# Altium schematic sheet Light Sensor.SchDoc: Solar Tracker - Light Sensor
size A4; SheetNumber: 2; SheetTotal: 3
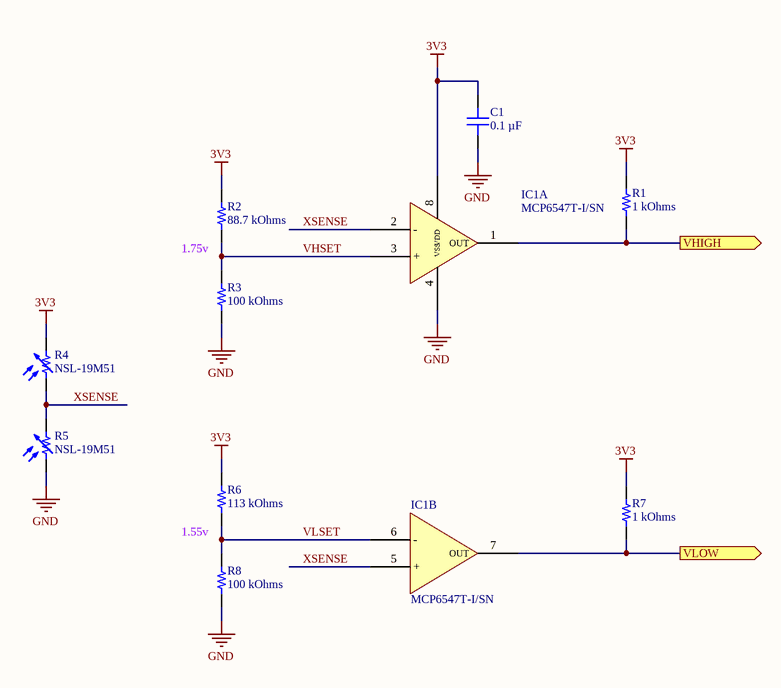
[diagram p0: Light Sensor.SchDoc]

## Parts
C1  0.1 µF  [CAP 0603_1608]
IC1  MCP6547T-I/SN  [MICROCHIP SOIC-8 SN]  (parts A,B of 2)
R1  1 kOhms  [RES 0603_1608]
R2  88.7 kOhms  [RES 0603_1608]
R3  100 kOhms  [RES 0603_1608]
R4  NSL-19M51  [ADVANCED PHOTONIX NSL-19M51]
R5  NSL-19M51  [ADVANCED PHOTONIX NSL-19M51]
R6  113 kOhms  [RES 0603_1608]
R7  1 kOhms  [RES 0603_1608]
R8  100 kOhms  [RES 0603_1608]

## Ports
VHIGH (out), VLOW (out)

## Nets
3V3: C1.2 IC1.8(VDD) R1.2 R2.2 R4.2 R6.2 R7.2
GND: C1.1 IC1.4(VSS) R3.1 R5.1 R8.1
VHIGH: IC1.1(OUT) R1.1 ; port VHIGH
VHSET: IC1.3(+) R2.1 R3.2
VLOW: IC1.7(OUT) R7.1 ; port VLOW
VLSET: IC1.6(-) R6.1 R8.2
XSENSE: IC1.2(-) IC1.5(+) R4.1 R5.2

## Notes on the sheet
- 1.75v
- 1.55v
- Title
- Size:
- Date:
- A4
- Number:
- Time:
- Revision:
- Sheet
- of
- File:

## Library data of the parts
C1 = C0603C104K5RAC7411: CAP CER 0.1UF 50V X7R 0603; manufacturer: KEMET; Tolerance: ±10%; Part Number: C0603C104K5RAC7411; Value: 0.1 µF; Applications: Bypass, Decoupling; Capacitance: 0.1 µF; componentlink1description: Datasheet; componentlink1url: https://api.kemet.com/component-edge/download/datasheet/C0603C104K5RAC7411.pdf; componentlink2description: DigiKey Link; componentlink2url: https://www.digikey.com/en/products/detail/kemet/C0603C104K5RAC7411/3317013; Device Package: 0603 (1608 Metric); lastupdated: 28/02/2022 16:36:23; Lifecycle Status: Active; Minimum Order: 15000; Mounting Type: Surface Mount, MLCC; Operating Temperature: -55°C ~ 125°C; Package / Case: 0603 (1608 Metric); packaging: TapeAndReel; partid: 2233; Part Status: Active; price: 0.01; series: SMD Comm X7R; Size / Dimension: 0.063" L x 0.031" W (1.60mm x 0.80mm); Supplier 1: DigiKey; Supplier Part Number 1: 399-7374-2-ND; Temperature Coefficient: X7R; Thickness (Max): 0.035" (0.90mm); Voltage - Rated: 50V
IC1 = MCP6547T-I/SN: IC COMP OPENDRN 1.6V DUAL 8-SOIC; Manufacturer: Microchip Technology; CMRR, PSRR (Typ): 70dB CMRR, 80dB PSRR; Current - Input Bias (Max): 1pA @ 5.5V; Current - Output (Typ): 30mA; Current - Quiescent (Max): 1µA; Hysteresis: 6.5mV; Number of Elements: 2; Output Type: CMOS, Open-Drain, Rail-to-Rail, TTL; Propagation Delay (Max): 8µs; Voltage - Input Offset (Max): 7mV @ 5.5V; Voltage - Supply, Single/Dual (±): 1.6V ~ 5.5V; Part Number: MCP6547T-I/SN; ComponentLink1Description: Datasheet; ComponentLink1URL: http://www.microchip.com/mymicrochip/filehandler.aspx?ddocname=en020853; ComponentLink2Description: DigiKey Link; ComponentLink2URL: https://www.digikey.com/en/products/detail/microchip-technology/MCP6547T-I-SN/458458; LastUpdated: 02/03/2022 20:22:27; Lifecycle Status: Active; Minimum Order: 1; Mounting Type: Surface Mount; Operating Temperature: -40°C ~ 85°C; Package / Case: 8-SOIC (0.154", 3.90mm Width); Packaging: TapeAndReel; Part Status: Active; Price: 0.53; Series: -; Supplier 1: DigiKey; Supplier Part Number 1: MCP6547T-I/SNCT-ND; Supplier Device Package: 8-SOIC; Type: General Purpose
R1 R7 = ERJ-PA3J102V: RES SMD 1K OHM 5% 1/4W 0603; Manufacturer: Panasonic Electronic Components; Power (Watts): 0.25W, 1/4W; Temperature Coefficient: ±200ppm/°C; Part Number: ERJ-PA3J102V; Value: 1 kOhms; ComponentLink1Description: Datasheet; ComponentLink1URL: https://industrial.panasonic.com/cdbs/www-data/pdf/RDO0000/AOA0000C331.pdf; ComponentLink2Description: DigiKey Link; ComponentLink2URL: https://www.digikey.com/en/products/detail/panasonic-electronic-components/ERJ-PA3J102V/5035970; Composition: Thick Film; Device Package: 0603 (1608 Metric); Features: Automotive AEC-Q200, Pulse Withstanding; Height - Seated (Max): 0.022" (0.55mm); LastUpdated: 28/02/2022 16:15:56; Lifecycle Status: Active; Minimum Order: 1; Number of Terminations: 2; Operating Temperature: -55°C ~ 155°C; Package / Case: 0603 (1608 Metric); Packaging: TapeAndReel; PartId: 17507; Part Status: Active; Price: 0.01; Ratings: AEC-Q200; Resistance: 1 kOhms; Series: ERJ-PA3; Size / Dimension: 0.063" L x 0.031" W (1.60mm x 0.80mm); Supplier 1: DigiKey; Supplier Part Number 1: P1KBZCT-ND; Supplier Device Package: 0603; Tolerance: ±5%
R2 = RC0603FR-0788K7L: RES 88.7K OHM 1% 1/10W 0603; Manufacturer: Yageo; Power (Watts): 0.1W, 1/10W; Temperature Coefficient: ±100ppm/°C; Part Number: RC0603FR-0788K7L; Value: 88.7 kOhms; ComponentLink1Description: Datasheet; ComponentLink1URL: https://www.yageo.com/upload/media/product/productsearch/datasheet/rchip/PYu-RC_Group_51_RoHS_L_10.pdf; ComponentLink2Description: DigiKey Link; ComponentLink2URL: https://www.digikey.com/en/products/detail/yageo/RC0603FR-0788K7L/727415; Composition: Thick Film; Device Package: 0603 (1608 Metric); Features: Moisture Resistant; Height - Seated (Max): 0.022" (0.55mm); LastUpdated: 28/02/2022 16:16:25; Lifecycle Status: Active; Minimum Order: 1; Number of Terminations: 2; Operating Temperature: -55°C ~ 155°C; Package / Case: 0603 (1608 Metric); Packaging: CutTape; PartId: 7595; Part Status: Active; Price: 0.01; Resistance: 88.7 kOhms; Series: RC_L; Size / Dimension: 0.063" L x 0.031" W (1.60mm x 0.80mm); Supplier 1: DigiKey; Supplier Part Number 1: 311-88.7KHRCT-ND; Supplier Device Package: 0603; Tolerance: ±1%
R3 R8 = ERJ-PA3F1003V: RES SMD 100K OHM 1% 1/4W 0603; Manufacturer: Panasonic Electronic Components; Power (Watts): 0.25W, 1/4W; Temperature Coefficient: ±100ppm/°C; Part Number: ERJ-PA3F1003V; Value: 100 kOhms; ComponentLink1Description: Datasheet; ComponentLink1URL: https://industrial.panasonic.com/cdbs/www-data/pdf/RDO0000/AOA0000C331.pdf; ComponentLink2Description: DigiKey Link; ComponentLink2URL: https://www.digikey.com/en/products/detail/panasonic-electronic-components/ERJ-PA3F1003V/5035850; Composition: Thick Film; Device Package: 0603 (1608 Metric); Features: Automotive AEC-Q200, Pulse Withstanding; Height - Seated (Max): 0.022" (0.55mm); LastUpdated: 28/02/2022 16:16:03; Lifecycle Status: Active; Minimum Order: 1; Number of Terminations: 2; Operating Temperature: -55°C ~ 155°C; Package / Case: 0603 (1608 Metric); Packaging: TapeAndReel; PartId: 14879; Part Status: Active; Price: 0.02; Ratings: AEC-Q200; Resistance: 100 kOhms; Series: ERJ-PA3; Size / Dimension: 0.063" L x 0.031" W (1.60mm x 0.80mm); Supplier 1: DigiKey; Supplier Part Number 1: P100KBYCT-ND; Supplier Device Package: 0603; Tolerance: ±1%
R4 R5 = NSL-19M51: PHOTOCELL; Manufacturer: Advanced Photonix; Cell Resistance @ Illuminance: 20 ~ 100kOhms @ 10 lux; Cell Resistance (Min) @ Dark: 20 MOhms @ 10 s; Voltage - Max: 100Vpk; Wavelength: 550nm; Part Number: NSL-19M51; ComponentLink1Description: Datasheet; ComponentLink1URL: https://lunainc.com/wp-content/uploads/2016/06/NSL-19M51.pdf; ComponentLink2Description: DigiKey Link; ComponentLink2URL: https://www.digikey.com/en/products/detail/advanced-photonix/NSL-19M51/5039794; Device Package: Radial; LastUpdated: 03/03/2022 12:53:42; Lifecycle Status: Active; Minimum Order: 1; Mounting Type: Through Hole; Operating Temperature: -60°C ~ 75°C (TA); Package / Case: Radial; Packaging: Bulk; Part Status: Active; Price: 0.61; Series: -; Supplier 1: DigiKey; Supplier Part Number 1: NSL-19M51-ND; Supplier Device Package: TO-18
R6 = RMCF0603FT113K: RES 113K OHM 1% 1/10W 0603; Manufacturer: Stackpole Electronics Inc; Power (Watts): 0.1W, 1/10W; Temperature Coefficient: ±100ppm/°C; Part Number: RMCF0603FT113K; Value: 113 kOhms; ComponentLink1Description: Datasheet; ComponentLink1URL: https://www.seielect.com/catalog/sei-rmcf_rmcp.pdf; ComponentLink2Description: DigiKey Link; ComponentLink2URL: https://www.digikey.com/en/products/detail/stackpole-electronics-inc/RMCF0603FT113K/1713567; Composition: Thick Film; Device Package: 0603 (1608 Metric); Features: Automotive AEC-Q200; Height - Seated (Max): 0.022" (0.55mm); LastUpdated: 28/02/2022 16:16:02; Lifecycle Status: Active; Minimum Order: 1; Number of Terminations: 2; Operating Temperature: -55°C ~ 155°C; Package / Case: 0603 (1608 Metric); Packaging: CutTape; PartId: 15681; Part Status: Active; Price: 0.01; Ratings: AEC-Q200; Resistance: 113 kOhms; Series: RMCF; Size / Dimension: 0.061" L x 0.031" W (1.55mm x 0.80mm); Supplier 1: DigiKey; Supplier Part Number 1: RMCF0603FT113KCT-ND; Supplier Device Package: 0603; Tolerance: ±1%